# EAGLE schematic power circuit v4 down (EAGLE 7.3.0)
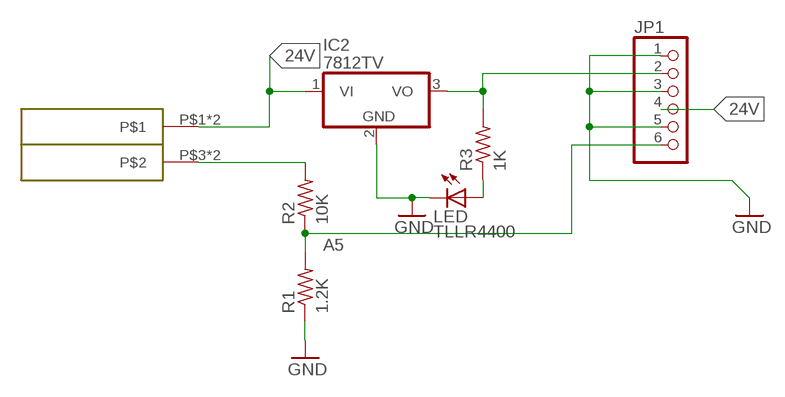
[diagram p0: schematic, sheet 1]

## Parts
IC2  7812TV  [TO220V]
JP1  PINHD-1X6B  [1X06-BIG]
LED  TLLR4400  [LED3MM]
R1  1.2K  R-US_0207/5V  [0207/5V]
R2  10K  R-US_0207/5V  [0207/5V]
R3  1K  R-US_0207/5V  [0207/5V]
U$1  MY-PLUG  [CON-SEG]

## Nets
24V: IC2.1(VI) JP1.4 U$1.P$1 U$1.P$2
A5: JP1.6 R1.2 R2.1
GND: IC2.2(GND) JP1.1 JP1.3 JP1.5 LED.K(C) R1.1
N$1: LED.A R3.1
N$2: IC2.3(VO) JP1.2 R3.2
N$4: R2.2 U$1.P$3 U$1.P$4

## Library data of the parts
IC2 = myParts:78*: Positive VOLTAGE REGULATOR Source: http://cache.national.com/ds/LM/LM78L05.pdf http://www.fairchildsemi.com/ds/LM/LM7805.pdf
JP1 = adafruit:PINHD-1X6: PIN HEADER
LED = led:TLLR4400: Low Current (2mA) LED 3 mm Tinted Diffused Package color RED Source: Data sheet <http://www.farnell.com/datasheets/391100.pdf>; MF: VISHAY SEMICONDUCTOR; OC_FARNELL: 1612437
R1-R3 = adafruit:R-US_: RESISTOR, American symbol
U$1 = my-custom:MY-PLUG